# EasyEDA Pro project ProPrj_泰山派屏幕转接板_2026-03-13.epro

# Schematic TM055VDXP35转接板
Assembly Variant: Basic; Board Name: Board1; Create Date: 2026-01-14; Page Name: P1; Project Name: 泰山派屏幕转接板; Schematic Name: Schematic1; Update Date: 2026-01-14; BladeWidth: 10; Company: 嘉立创EDA; Page Size: A4; RegionStart: 1; ShowBorder: 1; TitleBlock: 1; TitleBlockPosition: 3; Version: V1.0; XRegionCount: 6; YRegionCount: 4
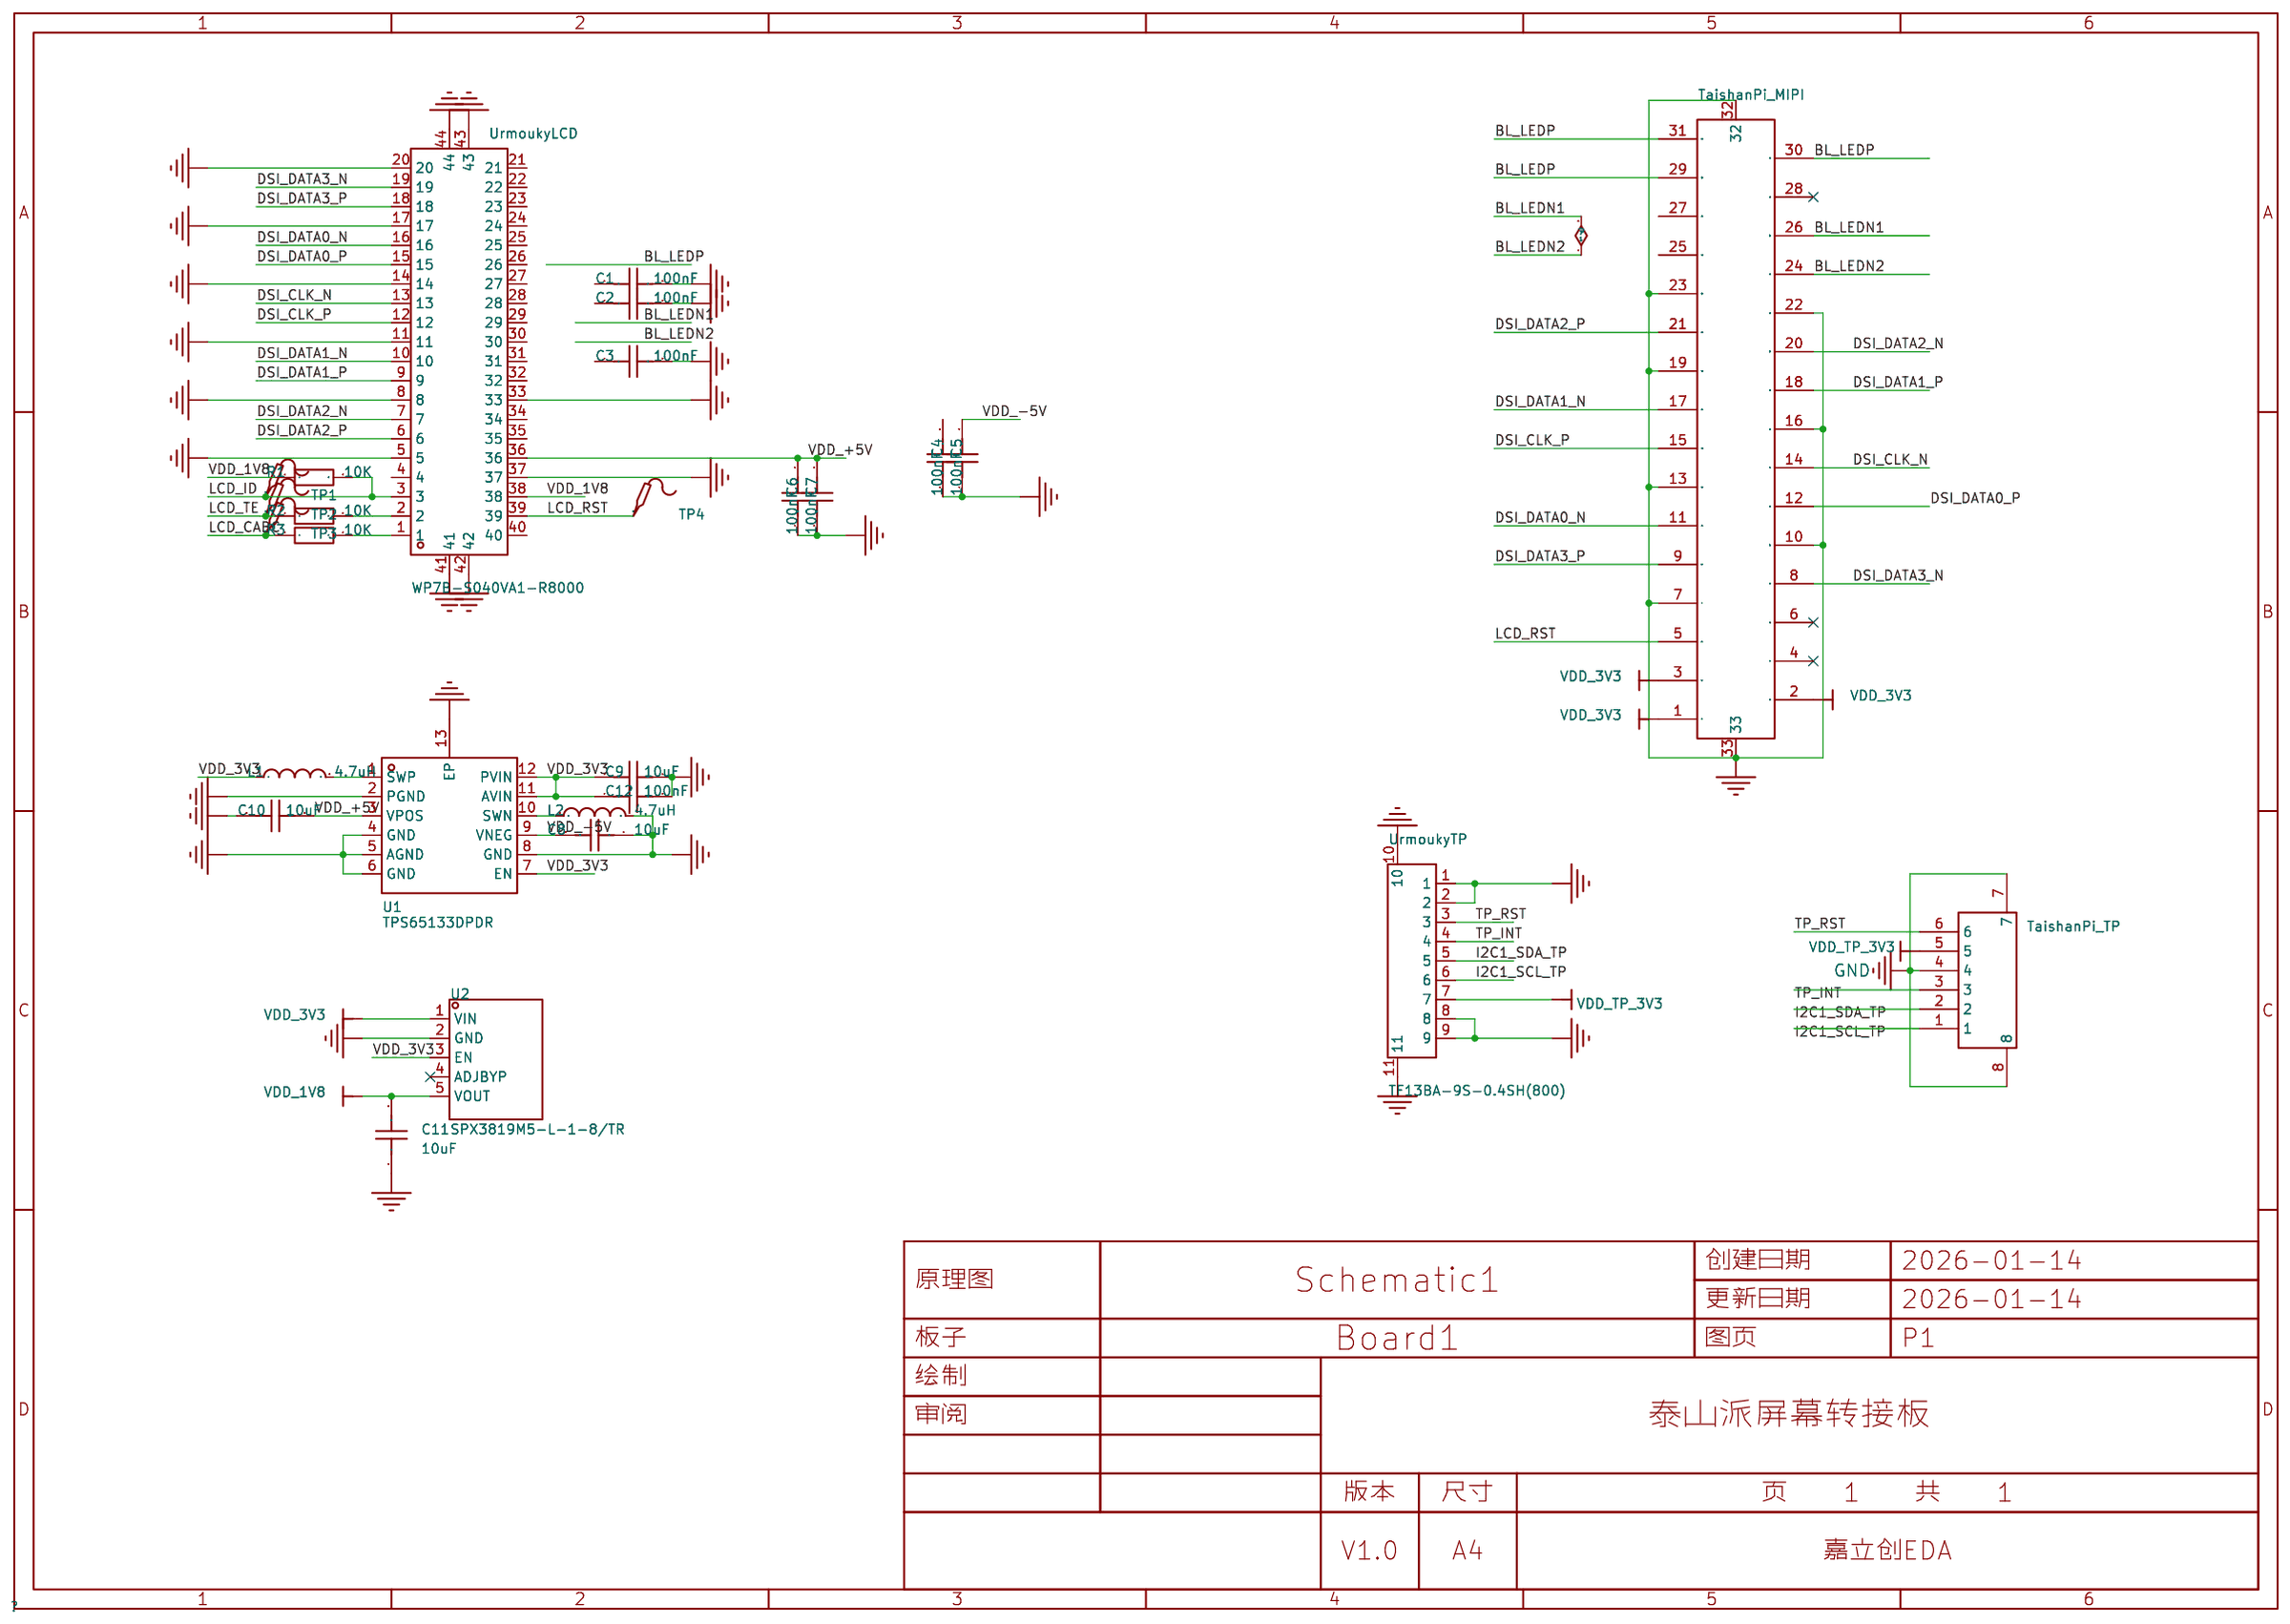
[diagram p0: schematic sheet]

## Parts
C1  100nF  [R0402]
C2  100nF  [R0402]
C3  100nF  [R0402]
C4  100nF  [R0402]  (no BOM)
C5  100nF  [R0402]
C6  100nF  [R0402]  (no BOM)
C7  100nF  [R0402]
C8  10uF  [C0603]
C9  10uF  [C0603]
C10  10uF  [C0603]
C11  10uF  [C0603]
C12  100nF  [R0402]
L1  4.7uH  [IND-SMD_L2.5-W2.0-VLS252012CX-150M]
L2  4.7uH  [IND-SMD_L2.5-W2.0-VLS252012CX-150M]
R1  10K  [R0402]
R2  10K  [R0402]
R3  10K  [R0402]
TaishanPi_MIPI  AFE03-S31FMA-1H  [FPC-SMD_P0.30-31P_FGS-XJ-H1.0]
TaishanPi_TP  AFC01-S06FCA-00  [FPC-SMD_P0.50-6P_AFC01-S06FCA-00]
TP1  -  [Test-Point-0.5mm]
TP2  -  [Test-Point-0.5mm]
TP3  -  [Test-Point-0.5mm]
TP4  -  [Test-Point-0.5mm]
U1  TPS65133DPDR  [WSON-12_L3.0-W3.0-P0.45-BL-EP]
U2  SPX3819M5-L-1-8/TR  [SOT-23-5_L3.0-W1.7-P0.95-LS2.8-TL]
UrmoukyLCD  WP7B-S040VA1-R8000  [CONN-SMD_40P-P0.40_WP7B-S040VA1-R8000]
UrmoukyTP  TF13BA-9S-0.4SH(800)  [FPC-SMD_9P-P0.40_TF13BA-9S-0.4SH800]

## Library data of the parts
C1-C12 = CAP_0603: Supplier Footprint: 0603
L1 L2 = FTC252010S4R7MBCA: 电感值:4.7uH;精度:±20%;额定电流:2A;饱和电流(Isat):2.6A;类型:-;; LCSC Part Name: 4.7uH ±20% 2.6A; Supplier Part: C5832360; Manufacturer: cjiang(长江微电); Supplier Footprint: 1008; JLCPCB Part Class: Extended Part; Datasheet: https://item.szlcsc.com/datasheet/FTC252010S4R7MBCA/6763480.html; Supplier: LCSC; Tolerance: ±20%; Current Rating: 2A; Current - Saturation(Isat): 2.6A; DC Resistance(DCR): 160mΩ
R1-R3 = Res_0603: Supplier Footprint: 0603
TaishanPi_MIPI = AFE03-S31FMA-1H: 间距:0.3mm;触点数量:31P;锁定特性:翻盖式;触点类型:下接;安装类型:卧贴;; LCSC Part Name: 间距:0.3mm P数:31P 翻盖式 下接; Supplier Part: C262545; Manufacturer: JS(钜硕电子); Supplier Footprint: SMD,P=0.3mm,卧贴; JLCPCB Part Class: 扩展库; Datasheet: https://atta.szlcsc.com/upload/public/pdf/source/20180905/C262550_883B4CF170134B85A57C97D291F71ACA.pdf; Supplier: LCSC; Pitch: 0.3mm; Number of Contacts: 31P; Locking Feature: 翻盖式; FFC, FCB Thickness: 0.2mm; Contact Type: 下接; Mounting Type: 卧贴; Height Above Board: 1mm
TaishanPi_TP = AFC01-S06FCA-00: 锁定特性:翻盖式;触点类型:下接;触点数量:6P;间距:0.5mm;安装类型:卧贴;; LCSC Part Name: 间距:0.5mm P数:6P 翻盖式 下接; Supplier Part: C262655; Manufacturer: JS(钜硕电子); Supplier Footprint: SMD,P=0.5mm,卧贴; JLCPCB Part Class: 扩展库; Datasheet: https://atta.szlcsc.com/upload/public/pdf/source/20190816/C413942_2A72D1AC756EAE17EEDF756A339D4500.pdf; Supplier: LCSC; Locking Feature: 翻盖式; Contact Type: 下接; Number of Contacts: 6P; Pitch: 0.5mm; Mounting Type: 卧贴; FFC, FCB Thickness: 0.3mm; Height Above Board: 2mm
TP1-TP4 = Test-Point: Test Point 测试点
U1 = TPS65133DPDR: 功能类型:升压型；升降压型;输出类型:固定;工作电压:2.9V~5V;输出电压:-5V；5V;输出电流:250mA;; LCSC Part Name: 双路5V输出电源管理芯片; Supplier Part: C134100; Manufacturer: TI(德州仪器); Supplier Footprint: WSON-12-EP(3x3); JLCPCB Part Class: Extended Part; Datasheet: https://www.ti.com/cn/lit/gpn/tps65133; Supplier: LCSC; Function: 升压型；升降压型; Output Type: 固定; Voltage - Supply: 2.9V~5V; Output Voltage: -5V；5V; Output Current: 250mA; Frequency - Switching: 1.7MHz；1.7MHz; Operating Temperature: -40℃~+85℃@(TA)；-40℃~+125℃@(TJ); Synchronous Rectifier: 是; Number of Outputs: 2; Switch tube (built-in/external): 内置
U2 = SPX3819M5-L-1-8/TR: 输出类型:固定;工作电压:20V;输出电压:1.8V;输出电流:500mA;电源纹波抑制比(PSRR):70dB;输出极性:正极;; LCSC Part Name: 1.8V 500mA 20V; Supplier Part: C24639; Manufacturer: MaxLinear(迈凌); Supplier Footprint: SOT-23-5; JLCPCB Part Class: Extended Part; Datasheet: https://item.szlcsc.com/datasheet/SPX3819M5-L-1-8%252FTR/25380.html; Supplier: LCSC; Output Type: 固定; Voltage - Supply: 20V; Output Voltage: 1.8V; Output Current: 500mA; Power Supply Rejection Ratio (PSRR): 70dB; Voltage Dropout: 340mV@(500mA); standby current: 90uA; Noise: 40uVrms; Features: 过流保护；反接保护；过热保护；带使能; Operating Temperature: -40℃~+125℃@(Tj); Output Configuration: 正极; Number of Outputs: 1
UrmoukyLCD = WP7B-S040VA1-R8000: PIN总数:40P;间距:0.4mm;安装方式:立贴;排数:2;; LCSC Part Name: 间距:0.4mm PIN:40P 母 立贴; Supplier Part: C3641249; Manufacturer: JAE(日本航空电子); Supplier Footprint: SMD,P=0.4mm; JLCPCB Part Class: Extended Part; Datasheet: https://item.szlcsc.com/datasheet/WP7B-S040VA1-R8000/4207994.html; Supplier: LCSC; Number of Pins: 40P; Pitch: 0.4mm; Mounting Type: 立贴; Number of Rows: 2; Contact Plating: 金
UrmoukyTP = TF13BA-9S-0.4SH(800): 锁定特性:翻盖式;触点类型:下接;触点数量:9P;间距:0.4mm;安装方式:卧贴;工作温度:-55℃~+85℃;; LCSC Part Name: 间距:0.4mm P数:9P 翻盖式 下接; Supplier Part: C3169216; Manufacturer: HRS(广濑); Supplier Footprint: SMD,P=0.4mm,卧贴; JLCPCB Part Class: Extended Part; Datasheet: https://item.szlcsc.com/datasheet/TF13BA-9S-0.4SH(800)/3731153.html; Supplier: LCSC; Locking Feature: 翻盖式; Contact Type: 下接; Number of Contacts: 9P; Pitch: 0.4mm; Mounting Type: 卧贴; FFC, FCB Thickness: 0.2mm; Height Above Board: 0.88mm; Contact Material: 磷青铜; Contact Plating: 金; Operating Temperature: -55℃~+85℃

## Nets
GND: C1.2 C2.2 C3.2 C4.1 C5.1 C6.1 C7.1 C8.1 C9.2 C10.2 C11.1 C12.2 L2.2 TaishanPi_MIPI.7 TaishanPi_MIPI.10 TaishanPi_MIPI.13 TaishanPi_MIPI.16 TaishanPi_MIPI.19 TaishanPi_MIPI.22 TaishanPi_MIPI.23 TaishanPi_MIPI.32 TaishanPi_MIPI.33 TaishanPi_TP.4 TaishanPi_TP.7 TaishanPi_TP.8 U1.2(PGND) U1.4(GND) U1.5(AGND) U1.6(GND) U1.8(GND) U1.13(EP) U2.2(GND) UrmoukyLCD.5 UrmoukyLCD.8 UrmoukyLCD.11 UrmoukyLCD.14 UrmoukyLCD.17 UrmoukyLCD.20 UrmoukyLCD.33 UrmoukyLCD.37 UrmoukyLCD.41 UrmoukyLCD.42 UrmoukyLCD.43 UrmoukyLCD.44 UrmoukyTP.1 UrmoukyTP.2 UrmoukyTP.8 UrmoukyTP.9 UrmoukyTP.10 UrmoukyTP.11
VDD_1V8: C11.2 R1.1 U2.5(VOUT) UrmoukyLCD.38
VDD_3V3: C9.1 C12.1 L1.1 TaishanPi_MIPI.1 TaishanPi_MIPI.2 TaishanPi_MIPI.3 U1.7(EN) U1.11(AVIN) U1.12(PVIN) U2.1(VIN) U2.3(EN)
VDD_+5V: C6.2 C7.2 C10.1 U1.3(VPOS) UrmoukyLCD.36
VDD_-5V: C4.2 C5.2 C8.2 U1.9(VNEG) UrmoukyLCD.34
VDD_TP_3V3: TaishanPi_TP.5 UrmoukyTP.7
BL_LEDN1: C2.1 C3.1 TaishanPi_MIPI.24 TaishanPi_MIPI.25 TaishanPi_MIPI.26 TaishanPi_MIPI.27 UrmoukyLCD.29 UrmoukyLCD.30
BL_LEDP: C1.1 TaishanPi_MIPI.29 TaishanPi_MIPI.30 TaishanPi_MIPI.31 UrmoukyLCD.26 UrmoukyLCD.27
DSI_CLK_N: TaishanPi_MIPI.14 UrmoukyLCD.13
DSI_CLK_P: TaishanPi_MIPI.15 UrmoukyLCD.12
DSI_DATA0_N: TaishanPi_MIPI.11 UrmoukyLCD.16
DSI_DATA0_P: TaishanPi_MIPI.12 UrmoukyLCD.15
DSI_DATA1_N: TaishanPi_MIPI.17 UrmoukyLCD.10
DSI_DATA1_P: TaishanPi_MIPI.18 UrmoukyLCD.9
DSI_DATA2_N: TaishanPi_MIPI.20 UrmoukyLCD.7
DSI_DATA2_P: TaishanPi_MIPI.21 UrmoukyLCD.6
DSI_DATA3_N: TaishanPi_MIPI.8 UrmoukyLCD.19
DSI_DATA3_P: TaishanPi_MIPI.9 UrmoukyLCD.18
I2C1_SCL_TP: TaishanPi_TP.1 UrmoukyTP.6
I2C1_SDA_TP: TaishanPi_TP.2 UrmoukyTP.5
LCD_CABC: R3.1 TP3.1
LCD_ID: R1.2 TP1.1 UrmoukyLCD.3
LCD_RST: TaishanPi_MIPI.5 TP4.1 UrmoukyLCD.39
LCD_TE: R2.1 TP2.1
TP_INT: TaishanPi_TP.3 UrmoukyTP.4
TP_RST: TaishanPi_TP.6 UrmoukyTP.3
$1N23: R2.2 UrmoukyLCD.2
$1N25: R3.2 UrmoukyLCD.1
$1N71: L1.2 U1.1(SWP)
$1N73: L2.1 U1.10(SWN)

Not connected (* = marked no-connect by the designer): TaishanPi_MIPI 4* 6* 28*; U2 4(ADJBYP)*; UrmoukyLCD 4 21 22 23 24 25 28 31 32 35 40

# Board TM055VDXP35转接板
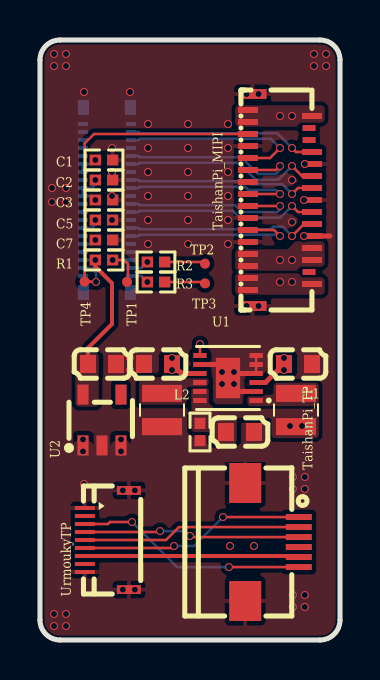
[diagram p1: board, top side]
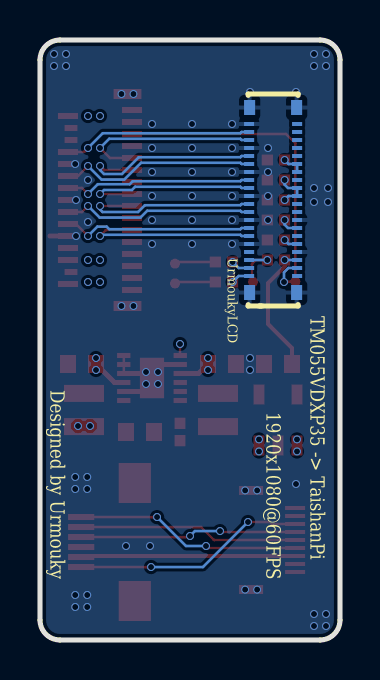
[diagram p2: board, bottom side, seen from below]

Outline 15 x 30 mm; copper layers: Top Layer, 内层2, 内层1, Bottom Layer. Coordinates in mm from the lower left corner of the outline.
Outline path: 0,29 0,1 arc(0.29,0.29) 1,0 14,0 arc(14.71,0.29) 15,1 15,29 arc(14.71,29.71) 14,30 1,30 arc(0.29,29.71) 0,29
Stack: Top Layer 0.035mm Outer layer thickness 1oz / Dielectric1 0.28mm 7628 RC49% 8.6mil / 内层2 0.035mm Inner layer thickness / Dielectric2 0.28mm 1.1mm H/HOZ Copper / 内层1 0.035mm Inner layer thickness / Dielectric3 0.28mm 7628 RC49% 8.6mil / Bottom Layer 0.035mm Outer layer thickness 1oz

## Design rules (mm)
net DSI_DATA2_P: DSI_DATA2
net DSI_DATA2_N: DSI_DATA2
net DSI_DATA1_P: DSI_DATA1
net DSI_DATA1_N: DSI_DATA1
net DSI_CLK_P: DSI_CLK
net DSI_CLK_N: DSI_CLK
net DSI_DATA0_P: DSI_DATA0
net DSI_DATA0_N: DSI_DATA0
net DSI_DATA3_P: DSI_DATA3
net DSI_DATA3_N: DSI_DATA3
spacing copperThickness1oz (default): track to track 0.102, other pairs 0.152 to 0.3
spacing copperThickness2oz: track to track 0.203, other pairs 0.152 to 0.3
spacing 精密铺铜: track to track 0.127, other pairs 0.127 to 0.3
track width copperThickness1oz (default): min 0.127, default 0.127, max 2.54
track width copperThickness2oz: min 0.203, default 0.254, max 2.54
differential pair differentialPair (default): width min 0.127, default 0.127, max 2.54; gap min 0.152, default 0.152
net GND uses copperRegion_copperThickness1oz
net BL_LEDP uses copperRegion_copperThickness1oz
net BL_LEDN1 uses copperRegion_copperThickness1oz
net VDD_3V3 uses copperRegion_精密铺铜, 精密铺铜
net VDD_1V8 uses copperRegion_copperThickness1oz
net $1N71 uses copperRegion_copperThickness1oz
net $1N73 uses copperRegion_copperThickness1oz
pour e205 uses 直连铺铜_精密铺铜, 精密铺铜
pour e203 uses 直连铺铜_精密铺铜, 精密铺铜
pour e201 uses 直连铺铜_精密铺铜, 精密铺铜
pour e208 uses 直连铺铜_精密铺铜, 精密铺铜
pour e214 uses 直连铺铜_精密铺铜, 精密铺铜
pour e283 uses copperThickness1oz, 直连铺铜_copperThickness1oz
pour e363 uses 直连铺铜_精密铺铜, 精密铺铜
pour e411 uses copperRegion_精密铺铜, 精密铺铜
pour e453 uses default, 直连铺铜_default
pour e459 uses 直连铺铜_copperThickness1oz

## Placement (name value [footprint] x y rotation side)
C1  100nF  [R0402]  3.2 24 0 top
C2  100nF  [R0402]  3.2 23 0 top
C3  100nF  [R0402]  3.2 22 0 top
C5  100nF  [R0402]  3.2 21 180 top
C7  100nF  [R0402]  3.2 20 180 top
C8  10uF  [C0603]  5.9 13.8 0 top
C9  10uF  [C0603]  10 10.4 0 top
C10  10uF  [C0603]  12.9 13.8 0 top
C11  10uF  [C0603]  3.1 13.8 180 top
C12  100nF  [R0402]  8 10.4 270 top
L1  4.7uH  [IND-SMD_L2.5-W2.0-VLS252012CX-150M]  12.8 11.5 90 top
L2  4.7uH  [IND-SMD_L2.5-W2.0-VLS252012CX-150M]  6.1 11.5 270 top
R1  10K  [R0402]  3.2 19 0 top
R2  10K  [R0402]  5.8 18.9 180 top
R3  10K  [R0402]  5.8 17.9 180 top
TaishanPi_MIPI  AFE03-S31FMA-1H  [FPC-SMD_P0.30-31P_FGS-XJ-H1.0]  12 22 270 top
TaishanPi_TP  AFC01-S06FCA-00  [FPC-SMD_P0.50-6P_AFC01-S06FCA-00]  11.6 4.9 270 top
TP1  -  [Test-Point-0.5mm]  4.35 17.9 0 top
TP2  -  [Test-Point-0.5mm]  8.25 18.82 0 top
TP3  -  [Test-Point-0.5mm]  8.25 17.83 0 top
TP4  -  [Test-Point-0.5mm]  2.23 17.92 0 top
U1  TPS65133DPDR  [WSON-12_L3.0-W3.0-P0.45-BL-EP]  9.4 13.1 90 top
U2  SPX3819M5-L-1-8/TR  [SOT-23-5_L3.0-W1.7-P0.95-LS2.8-TL]  3.1 11 90 top
UrmoukyLCD  WP7B-S040VA1-R8000  [CONN-SMD_40P-P0.40_WP7B-S040VA1-R8000]  3.34 22 90 bottom
UrmoukyTP  TF13BA-9S-0.4SH(800)  [FPC-SMD_9P-P0.40_TF13BA-9S-0.4SH800]  3.34 5 90 top

## Footprints (pads in the part's own frame, mm; a bottom-side part is the same pattern mirrored in y, then rotated)
C0603
  rect 0.8x0.9 smd: 1(-0.7,0) 2(0.7,0)
CONN-SMD_40P-P0.40_WP7B-S040VA1-R8000
  rect 0.2x0.5 smd: 1(-3.8,1.2) 2(-3.4,1.2) 3(-3,1.2) 4(-2.6,1.2) 5(-2.2,1.2) 6(-1.8,1.2) 7(-1.4,1.2) 8(-1,1.2) 9(-0.601,1.2) 10(-0.2,1.2) 11(0.2,1.2) 12(0.6,1.2) 13(1,1.2) 14(1.399,1.2) 15(1.8,1.2) 16(2.2,1.2) 17(2.6,1.2) 18(2.999,1.2) 19(3.4,1.2) 20(3.8,1.2) 21(3.8,-1.2) 22(3.4,-1.2) 23(2.999,-1.2) 24(2.6,-1.2) 25(2.2,-1.2) 26(1.8,-1.2) 27(1.399,-1.2) 28(1,-1.2) 29(0.6,-1.2) 30(0.2,-1.2) 31(-0.2,-1.2) 32(-0.601,-1.2) 33(-1,-1.2) 34(-1.4,-1.2) 35(-1.8,-1.2) 36(-2.2,-1.2) 37(-2.6,-1.2) 38(-3,-1.2) 39(-3.4,-1.2) 40(-3.8,-1.2)
  rect 0.75x0.55 smd: 41(-4.625,-1.175) 42(-4.625,1.175) 43(4.625,1.175) 44(4.625,-1.175)
FPC-SMD_9P-P0.40_TF13BA-9S-0.4SH800
  rect 0.2x1 smd: 1(1.6,1.1) 2(1.2,1.1) 3(0.8,1.1) 4(0.4,1.1) 5(0,1.1) 6(-0.4,1.1) 7(-0.8,1.1) 8(-1.2,1.1) 9(-1.6,1.1)
  rect 0.44x1.2 smd: 10(-2.48,-1.1) 11(2.48,-1.1)
FPC-SMD_P0.30-31P_FGS-XJ-H1.0
  rect 0.3x1 smd: 1(-4.5,-1.603) 2(-4.2,1.603) 3(-3.9,-1.603) 5(-3.3,-1.603) 7(-2.7,-1.603) 8(-2.4,1.603) 9(-2.1,-1.603) 10(-1.8,1.603) 11(-1.5,-1.603) 12(-1.2,1.603) 13(-0.9,-1.603) 14(-0.6,1.603) 15(-0.3,-1.603) 16(0,1.603) 17(0.3,-1.603) 18(0.6,1.603) 19(0.9,-1.603) 20(1.2,1.603) 21(1.5,-1.603) 22(1.8,1.603) 23(2.1,-1.603) 24(2.4,1.603) 25(2.7,-1.603) 26(3,1.603) 27(3.3,-1.603) 29(3.9,-1.603) 30(4.2,1.603) 31(4.5,-1.603)
  rect 0.3x0.65 smd: 4(-3.6,1.453) 6(-3,1.453) 28(3.6,1.453)
  rect 0.5x1.4 smd: 32(-5.3,-1.373) 33(5.3,-1.373)
FPC-SMD_P0.50-6P_AFC01-S06FCA-00
  rect 0.3x1.3 smd: 1(-1.248,1.339) 2(-0.748,1.339) 3(-0.248,1.339) 4(0.252,1.339) 5(0.752,1.339) 6(1.252,1.339)
  rect 2x1.6 smd: 7(-2.95,-1.339) 8(2.95,-1.339)
IND-SMD_L2.5-W2.0-VLS252012CX-150M
  rect 0.85x2 smd: 1(-0.83,0) 2(0.83,0)
R0402
  rect 0.566x0.54 smd: 1(-0.433,0) 2(0.433,0)
SOT-23-5_L3.0-W1.7-P0.95-LS2.8-TL
  rect 1x0.55 smd: 1(-1.272,0.95) 2(-1.272,0) 3(-1.272,-0.95) 4(1.272,-0.95) 5(1.272,0.95)
Test-Point-0.5mm
  round 0.5 smd: 1(0,0)
WSON-12_L3.0-W3.0-P0.45-BL-EP
  rect 0.252x0.665 smd: 1(-1.125,-1.407) 2(-0.675,-1.407) 3(-0.225,-1.407) 4(0.225,-1.407) 5(0.675,-1.407) 6(1.125,-1.407) 7(1.125,1.407) 8(0.675,1.407) 9(0.225,1.407) 10(-0.225,1.407) 11(-0.675,1.407) 12(-1.125,1.407)
  rect 2.02x1.21 smd: 13(0,0)

## Nets
As in the schematic.

Pads without a net: TaishanPi_MIPI 4 6 28; U2 4; UrmoukyLCD 4 21 22 23 24 25 28 31 32 35 40

## Via types
v1: diameter 0.4, hole 0.3, Top Layer to Bottom Layer, 113 vias

## Routing (per net, layer and track width the routed paths; a pad name or vN(x,y) marks a point on that pad's centre or on a via; arc(x,y) is an arc through that point)
GND: length 7.2
  Top Layer w0.127: U1.4 U1.6 ; 9.03,13.78 9.4,13.4 U1.13 9.62,13.33
  Top Layer w0.25: U1.2 9.4,12.42 U1.13 ; U1.4 9.62,13.33 ; TaishanPi_MIPI.22 14.5,20.2 ; 7.99,13.78 9.03,13.78
  vias: v1(0.6,22.6) v1(0.6,21.9) v1(0.7,29.3) v1(0.7,28.7) v1(0.7,1.3) v1(0.7,0.7) v1(1.3,29.3) v1(1.3,28.7) v1(1.3,22.6) v1(1.3,21.9) v1(1.3,1.3) v1(1.3,0.7) v1(2.2,27.4) v1(2.2,7.8) v1(3.6,24.6) v1(3.6,23.4) v1(3.6,22.2) v1(3.6,21) v1(4.14,7.48) v1(4.14,2.52) v1(4.5,27.4) v1(4.5,14.1) v1(4.5,13.5) v1(4.74,7.48) v1(4.74,2.52) v1(5.4,25.8) v1(5.4,24.6) v1(5.4,23.4) v1(5.4,22.2) v1(5.4,21) v1(5.4,19.8) v1(7.4,25.8) v1(7.4,24.6) v1(7.4,23.4) v1(7.4,22.2) v1(7.4,21) v1(7.4,19.8) v1(9.1,13.4) v1(9.1,12.8) v1(9.4,25.8) v1(9.4,24.6) v1(9.4,23.4) v1(9.4,22.2) v1(9.4,21) v1(9.4,19.8) v1(9.5,4.7) v1(9.7,13.4) v1(9.7,12.8) v1(10.33,27.3) v1(10.33,16.7) v1(10.7,4.7) v1(10.93,27.3) v1(10.93,16.7) v1(12.6,23) v1(12.6,20.9) v1(12.64,8.15) v1(12.64,7.55) v1(12.64,2.25) v1(12.64,1.65) v1(13.24,23.8) v1(13.2,22) v1(13.2,20.2) v1(13.24,8.15) v1(13.24,7.55) v1(13.24,2.25) v1(13.24,1.65) v1(13.7,29.3) v1(13.7,28.7) v1(14.3,29.3) v1(14.3,28.7)
VDD_1V8: length 6.7
  Top Layer w0.2: C11.2 2.4,14.6 3.6,15.8 3.6,17.84 2.77,18.67 v1(2.77,19)
  Bottom Layer w0.127: UrmoukyLCD.38 v1(2.77,19)
VDD_3V3: length 6.3
  Top Layer w0.127: U1.7 8,14.23 v1(8,14.8)
  内层1 w0.127: v1(8,14.8) 8,9.7 ; v1(12,26.2) v1(12.6,26.2)
  vias: v1(2.15,10.03) v1(2.15,9.43) v1(4.05,10.03) v1(4.05,9.43) v1(12.5,10.7) v1(13.1,10.7)
VDD_+5V: length 19.6
  Top Layer w0.25: U1.3 11.28,12.88 C10.1
  内层1 w0.4: v1(2.77,20) 1.9,20 1.6,19.7 1.6,16.5 2.1,16 11,16 12.2,14.8 v1(12.2,14.1) v1(12.2,13.5)
  Bottom Layer w0.127: v1(2.77,20) 2.57,19.8 UrmoukyLCD.36
VDD_-5V: length 16.3
  Top Layer w0.25: C8.2 7.07,13.33 U1.9
  内层1 w0.4: v1(2.77,21) 1.5,21 1,20.5 1,16.2 1.8,15.4 6,15.4 6.6,14.8 v1(6.6,14.1) v1(6.6,13.5)
  Bottom Layer w0.127: v1(2.77,21) 2.77,20.77 2.6,20.6 UrmoukyLCD.34
VDD_TP_3V3: length 10.7
  Top Layer w0.2: UrmoukyTP.7 12.89,4.2 TaishanPi_TP.5
BL_LEDN1: length 20.1
  内层1 w0.4: v1(12,19) 12.7,19 13.3,18.4 13.3,17.3 13.02,17.02 11.78,17.02 11.55,17.25 8.05,17.25 7.5,16.7 4.9,16.7 4.2,17.4 4.2,21.2 3.8,21.6 3.17,21.6 v1(2.77,22)
  Bottom Layer w0.127: v1(2.77,23) 2.77,22.77 2.6,22.6 UrmoukyLCD.29 UrmoukyLCD.30 2.57,22.2 v1(2.77,22)
  vias: v1(12.6,19)
BL_LEDP: length 17.2
  内层1 w0.4: v1(2.77,24) 4,24 4.8,23.2 4.8,17.7 4.81,17.69 4.81,17.67 5.14,17.35 7.25,17.35 7.8,17.9 v1(12,17.9) v1(12.6,17.9)
  Bottom Layer w0.127: v1(2.77,24) 2.57,23.8 UrmoukyLCD.26 UrmoukyLCD.27
DSI_CLK_N: length 9.5
  Top Layer w0.127: v1(12.6,22.3) 12.9,22.6 TaishanPi_MIPI.14
  Bottom Layer w0.127: UrmoukyLCD.13 4.92,23 4.98,22.94 10.36,22.94 10.51,22.79 12.11,22.79 v1(12.6,22.3)
DSI_CLK_P: length 9.2
  Top Layer w0.127: TaishanPi_MIPI.15 v1(12,22.3)
  Bottom Layer w0.127: v1(12,22.3) 11.8,22.5 10.41,22.5 10.24,22.66 4.98,22.66 4.92,22.6 UrmoukyLCD.12
DSI_DATA0_N: length 9.8
  Top Layer w0.127: v1(12,23.7) 11.8,23.5 TaishanPi_MIPI.11
  Bottom Layer w0.127: UrmoukyLCD.16 4.92,24.2 4.98,24.14 10.06,24.14 10.9,23.3 11.8,23.3 12,23.5 v1(12,23.7)
DSI_DATA0_P: length 9.9
  Top Layer w0.127: v1(12.6,23.7) 13.1,23.2 TaishanPi_MIPI.12
  Bottom Layer w0.127: UrmoukyLCD.15 4.92,23.8 4.98,23.86 9.94,23.86 10.78,23.02 11.92,23.02 v1(12.6,23.7)
DSI_DATA1_N: length 9.4
  Top Layer w0.127: 10.4,21.7 v1(12,21.7)
  Bottom Layer w0.127: v1(12,21.7) 12,21.53 11.87,21.4 10.09,21.4 9.76,21.74 4.98,21.74 4.92,21.8 UrmoukyLCD.10
DSI_DATA1_P: length 9.6
  Top Layer w0.127: v1(12.6,21.7) 12.9,21.4 TaishanPi_MIPI.18
  Bottom Layer w0.127: v1(12.6,21.7) 12.59,21.7 12.02,21.12 9.98,21.12 9.64,21.46 4.98,21.46 4.92,21.4 UrmoukyLCD.9
DSI_DATA2_N: length 9.6
  Top Layer w0.127: TaishanPi_MIPI.20 13.2,20.8 v1(12.6,20.2)
  Bottom Layer w0.127: v1(12.6,20.2) 12.13,20.67 11.67,20.67 11.54,20.54 4.98,20.54 4.92,20.6 UrmoukyLCD.7
DSI_DATA2_P: length 9.2
  Top Layer w0.127: TaishanPi_MIPI.21 11.7,20.5 v1(12,20.2)
  Bottom Layer w0.127: v1(12,20.2) 11.94,20.26 4.98,20.26 4.92,20.2 UrmoukyLCD.6
DSI_DATA3_N: length 9.5
  Top Layer w0.127: TaishanPi_MIPI.8 12.8,24.4 v1(12.6,24.6)
  Bottom Layer w0.127: v1(12.6,24.6) 11.86,25.34 4.98,25.34 4.92,25.4 UrmoukyLCD.19
DSI_DATA3_P: length 9.5
  Top Layer w0.127: TaishanPi_MIPI.9 11.5,24.1 v1(12,24.6)
  Bottom Layer w0.127: v1(12,24.6) 11.54,25.06 4.98,25.06 4.92,25 UrmoukyLCD.18
I2C1_SCL_TP: length 11.3
  Top Layer w0.127: TaishanPi_TP.1 v1(9.15,6.15) ; v1(6.7,4.7) 6.6,4.6 UrmoukyTP.6
  Bottom Layer w0.127: v1(6.7,4.7) 7.7,4.7 v1(9.15,6.15)
I2C1_SDA_TP: length 11
  Top Layer w0.127: UrmoukyTP.5 6.3,5 6.95,5.65 TaishanPi_TP.2
LCD_CABC: length 2
  Top Layer w0.127: TP3.1 8.18,17.9 R3.1
LCD_ID: length 2.7
  Top Layer w0.127: TP1.1 4.4,17.95 4.4,18.8 4.2,19 v1(3.63,19)
  Bottom Layer w0.127: v1(3.63,19) UrmoukyLCD.3
LCD_RST: length 17.1
  Top Layer w0.127: v1(2.8,17.9) 2.78,17.92 TP4.1 2.23,24.83 2.7,25.3 TaishanPi_MIPI.5
  Bottom Layer w0.127: v1(2.8,17.9) 2.8,18.38 2.58,18.6 UrmoukyLCD.39
LCD_TE: length 2.1
  Top Layer w0.127: TP2.1 8.17,18.9 R2.1
TP_INT: length 10.9
  Top Layer w0.127: UrmoukyTP.4 6,5.4 v1(6,5.45) ; v1(7.5,5.2) 7.55,5.15 TaishanPi_TP.3
  Bottom Layer w0.127: v1(6,5.45) 7.25,5.45 v1(7.5,5.2)
TP_RST: length 11.7
  Top Layer w0.127: TaishanPi_TP.6 v1(9.45,3.65) ; v1(4.6,5.9) 3.5,5.9 3.4,5.8 UrmoukyTP.3
  Bottom Layer w0.127: v1(4.6,5.9) 6.85,3.65 v1(9.45,3.65)
$1N23: length 0.9
  Bottom Layer w0.127: UrmoukyLCD.2 5.07,18.6 v1(5.37,18.9)
$1N25: length 0.9
  Bottom Layer w0.127: UrmoukyLCD.1 5.07,18.2 v1(5.37,17.9)

## Copper pours and planes (outline as drawn; the poured copper is in the pictures)
GND on Top Layer: 14.9,15.7 15,15.6 15,8.9 -0.1,8.9 -0.1,15.7
GND on Top Layer: 0,30 15,30 15,0 0,0
GND on Bottom Layer: 0,30 15,30 15,0 0,0
GND on 内层2: 0,30 15,30 15,0 0,0
GND on 内层1: 0,30 15,30 15,0 0,0
VDD_1V8 on Top Layer: 1.9,14.3 2.8,14.3 2.9,14.2 2.9,11.8 2.8,11.7 1.9,11.7 1.8,11.8 1.8,14.2
VDD_3V3 on Top Layer: 9.7,9.83 8.7,9.83 8.6,9.93 8.6,10.33 8.5,10.43 7.7,10.43 7.6,10.53 7.6,12.53 7.7,12.63 8.3,12.63 8.4,12.53 8.4,11.83 8.7,11.53 13.9,11.53 13.9,10.23 13.8,10.13 11.7,10.13 11.6,10.23 11.6,11.03 11.5,11.13 9.9,11.13 9.8,11.03 9.8,9.93
VDD_3V3 on Top Layer: 9.9,26.7 14.1,26.7 14.2,26.6 14.2,26 14.1,25.9 13,25.9 12.8,25.7 9.9,25.7 9.8,25.8 9.8,26.6
VDD_3V3 on 内层1: 15,10.2 12.4,10.2 12.3,10.1 12.3,9.2 12.2,9.1 1.9,9.1 1.8,9.2 1.8,10.2 1.9,10.3 11.4,10.3 11.5,10.4 11.5,11 11.6,11.1 14,11.1 14.1,11.2 14.1,25.8 14,25.9 13,25.9 12.8,25.7 11.8,25.7 11.7,25.8 11.7,26.6 11.8,26.7 15,26.7
BL_LEDN1 on Top Layer: 9.9,19.5 12.4,19.5 12.8,19.9 14.1,19.9 14.2,19.8 14.2,18.8 14.1,18.7 13,18.7 12.8,18.5 9.9,18.5 9.8,18.6 9.8,19.4
BL_LEDP on Top Layer: 9.9,18.3 12.9,18.3 13.1,18.1 14.1,18.1 14.2,18 14.2,17.4 14.1,17.3 9.9,17.3 9.8,17.4 9.8,18.2
$1N71 on Top Layer: 13.9,12.73 13.9,11.73 10.5,11.73 10.4,11.83 10.4,12.13 10.5,12.23 11.6,12.23 11.7,12.33 11.7,12.73 11.8,12.83 13.8,12.83
$1N73 on Top Layer: 5,11.8 5,13.1 8.3,13.1 8.4,13 8.4,12.8 8.3,12.7 7.4,12.7 7.3,12.6 7.3,11.9 7.2,11.8

Small or netless copper shapes (teardrops, artwork), in the pictures only: 1 on Top Layer

## Text on the board
Bottom Silkscreen Layer: TM055VDXP35 -> TaishanPi | 1920x1080@60FPS | Designed by Urmouky
